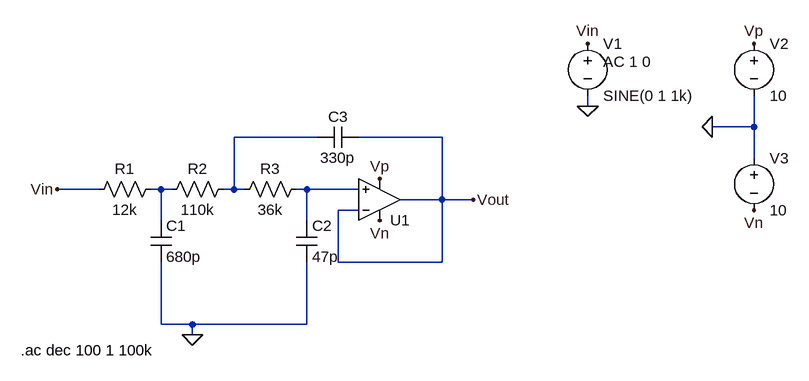
[diagram p0: schematic 3rd order low pass filter.asc]
3rd order low pass filter.asc, the LTspice schematic file:
Version 4
SHEET 1 880 680
WIRE 544 -64 544 -80
WIRE 800 -32 800 -80
WIRE 800 -32 736 -32
WIRE 128 -16 0 -16
WIRE 320 -16 192 -16
WIRE 800 16 800 -32
WIRE -208 64 -272 64
WIRE -112 64 -128 64
WIRE -96 64 -112 64
WIRE 0 64 0 -16
WIRE 0 64 -16 64
WIRE 16 64 0 64
WIRE 112 64 96 64
WIRE 192 64 112 64
WIRE 320 80 320 -16
WIRE 320 80 256 80
WIRE 368 80 320 80
WIRE 192 96 160 96
WIRE -112 112 -112 64
WIRE 112 112 112 64
WIRE 160 176 160 96
WIRE 320 176 320 80
WIRE 320 176 160 176
WIRE -112 272 -112 176
WIRE -64 272 -112 272
WIRE 112 272 112 176
WIRE 112 272 -64 272
WIRE -64 288 -64 272
FLAG -272 64 Vin
FLAG -64 288 0
FLAG 368 80 Vout
FLAG 224 48 Vp
FLAG 224 112 Vn
FLAG 544 -64 0
FLAG 736 -32 0
FLAG 800 -160 Vp
FLAG 800 96 Vn
FLAG 544 -160 Vin
SYMBOL OpAmps\\UniversalOpAmp 224 80 M180
SYMATTR InstName U1
SYMBOL res -112 48 R90
WINDOW 0 0 56 VBottom 2
WINDOW 3 32 56 VTop 2
SYMATTR InstName R1
SYMATTR Value 12k
SYMBOL res 0 48 R90
WINDOW 0 0 56 VBottom 2
WINDOW 3 32 56 VTop 2
SYMATTR InstName R2
SYMATTR Value 110k
SYMBOL res 112 48 R90
WINDOW 0 0 56 VBottom 2
WINDOW 3 32 56 VTop 2
SYMATTR InstName R3
SYMATTR Value 36k
SYMBOL cap -128 112 R0
SYMATTR InstName C1
SYMATTR Value 680p
SYMBOL cap 96 112 R0
SYMATTR InstName C2
SYMATTR Value 47p
SYMBOL cap 192 -32 R90
WINDOW 0 0 32 VBottom 2
WINDOW 3 32 32 VTop 2
SYMATTR InstName C3
SYMATTR Value 330p
SYMBOL voltage 544 -176 R0
WINDOW 123 24 44 Left 2
WINDOW 39 0 0 Left 0
SYMATTR Value2 AC 1 0
SYMATTR InstName V1
SYMATTR Value SINE(0 1 1k)
SYMBOL voltage 800 -176 R0
WINDOW 123 0 0 Left 0
WINDOW 39 0 0 Left 0
SYMATTR InstName V2
SYMATTR Value 10
SYMBOL voltage 800 0 R0
WINDOW 123 0 0 Left 0
WINDOW 39 0 0 Left 0
SYMATTR InstName V3
SYMATTR Value 10
TEXT -328 312 Left 2 !.ac dec 100 1 100k

The netlist it stands for:
* 3rd order low pass filter.asc
XU1 N003 Vout Vn Vp Vout level1 Avol=1Meg GBW=10Meg Vos=0 En=0 Enk=0 In=0 Ink=0 Rin=500Meg  ; pins In+ In- V+ V- OUT
R1 N002 Vin 12k
R2 N001 N002 110k
R3 N003 N001 36k
C1 N002 0 680p
C2 N003 0 47p
C3 Vout N001 330p
V1 Vin 0 SINE(0 1 1k) AC 1 0
V2 Vp 0 10
V3 0 Vn 10
.ac dec 100 1 100k
.lib UniversalOpAmp1.lib
.backanno
.end